# Altium schematic sheet QRE1113-2.SchDoc
size A
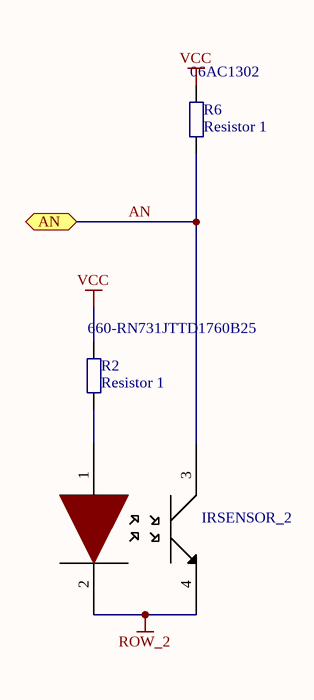
[diagram p0: QRE1113-2.SchDoc]

## Parts
IRSENSOR_2  QRE1113GR  [QRE1113GR]  (value not drawn)
R2  Resistor 1  Supplier Part Number 1: 660-RN731JTTD1760B25  [R-0603]
R6  Resistor 1  Supplier Part Number 1: 06AC1302  [R-0603]

## Ports
AN

## Nets
ROW_2: IRSENSOR_2.2 IRSENSOR_2.4
VCC: R2.2 R6.1
AN: IRSENSOR_2.3 R6.2 ; port AN
NetIRSENSOR_2_1: IRSENSOR_2.1 R2.1

## Library data of the parts
R2 R6 = Resistor 1: Resistor; Value: 1K
  R2: Supplier 1: Mouser
  R6: Supplier 1: Newark